# EAGLE design flexdrive_rev0 (EAGLE 6.5.0)
REV: 0; TITLE: FlexDrive

## Sheet 1 of 2
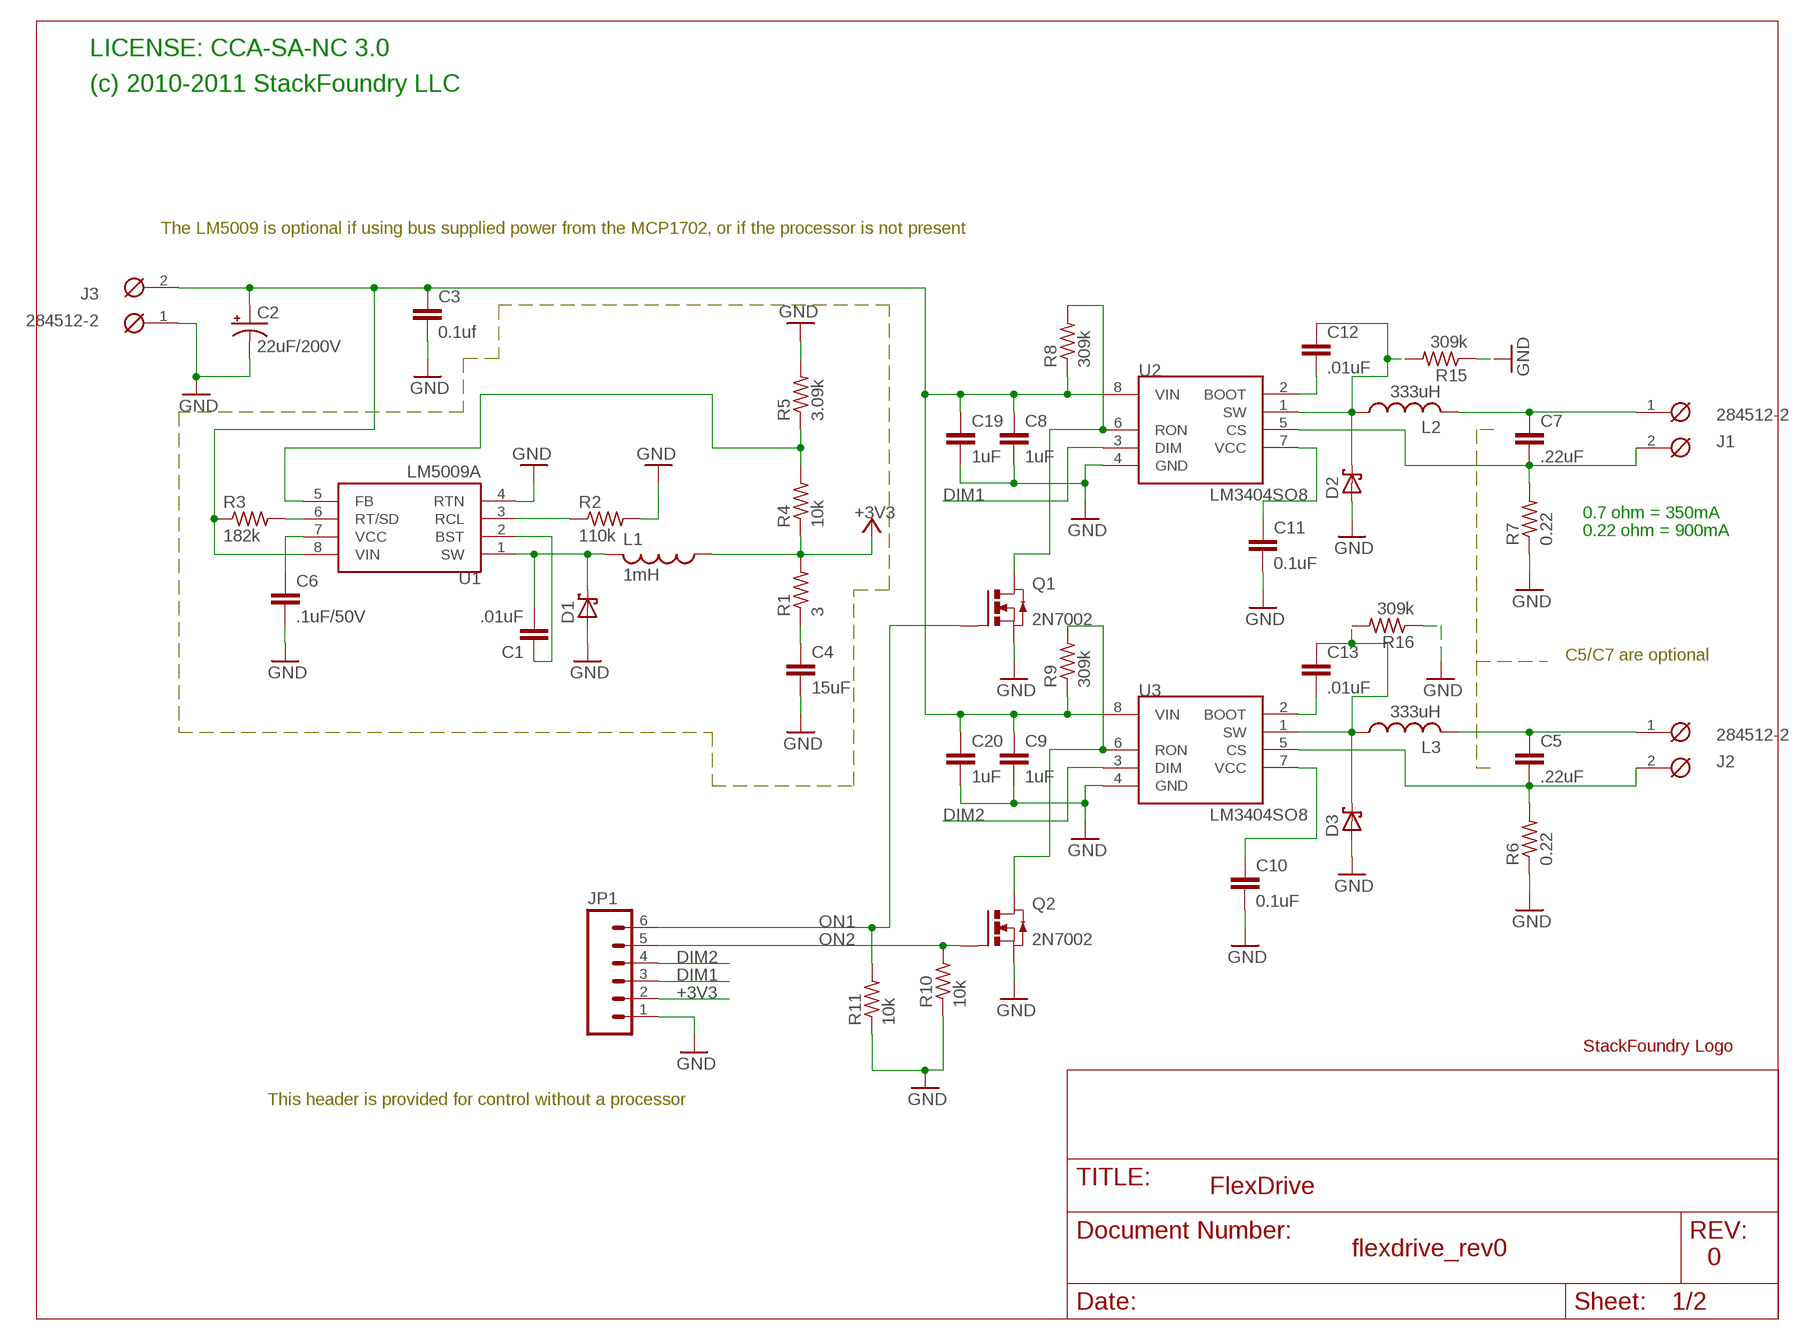
[diagram p0: schematic, sheet 1]

### Parts
C1  .01uF  C-EUC0603  [C0603]
C2  22uF/200V  CPOL-USE5-10.5  [E5-10,5]
C3  0.1uf  C-EUC0805  [C0805]
C4  15uF  C-EUTANTD_R  [CT7343]
C5  .22uF  C-EUC1206  [C1206]
C6  .1uF/50V  C-EUC1206  [C1206]
C7  .22uF  C-EUC1206  [C1206]
C8  1uF  C-EUC1206  [C1206]
C9  1uF  C-EUC1206  [C1206]
C10  0.1uF  C-EUC1206  [C1206]
C11  0.1uF  C-EUC1206  [C1206]
C12  .01uF  C-EUC1206  [C1206]
C13  .01uF  C-EUC1206  [C1206]
C19  1uF  C-EUC1206  [C1206]
C20  1uF  C-EUC1206  [C1206]
D1  SCHOTTKY-DIODESMA  [SMA]
D2  SCHOTTKY-DIODESMA  [SMA]
D3  SCHOTTKY-DIODESMA  [SMA]
J1  284512-2  [284512-2]
J2  284512-2  [284512-2]
J3  284512-2  [284512-2]
JP1  M06SIP  [1X06]
L1  1mH  L-USMSS1246  [MSS1246]
L2  333uH  L-USDO5040H  [DO5040H]
L3  333uH  L-USDO5040H  [DO5040H]
LOGO1  SFLOGO  [SFLOGO]
Q1  2N7002  [SOT23]
Q2  2N7002  [SOT23]
R1  3  R-US_R0603  [R0603]
R2  110k  R-US_R0603  [R0603]
R3  182k  R-US_R0603  [R0603]
R4  10k  R-US_R0603  [R0603]
R5  3.09k  R-US_R0603  [R0603]
R6  0.22  R-US_R1206  [R1206]
R7  0.22  R-US_R1206  [R1206]
R8  309k  R-US_R0805  [R0805]
R9  309k  R-US_R0805  [R0805]
R10  10k  R-US_R0603  [R0603]
R11  10k  R-US_R0603  [R0603]
R15  309k  R-US_R0805  [R0805]
R16  309k  R-US_R0805  [R0805]
U1  LM5009A  [MSOP-8]
U2  LM3404SO8  [SO08]
U3  LM3404SO8  [SO08]

### Nets
+3V3: JP1.2 L1.1 R1.2 R4.1 ; also sheet 2
DIM1: JP1.3 U2.3(DIM) ; also sheet 2
DIM2: JP1.4 U3.3(DIM) ; also sheet 2
GND: C2.- C3.2 C4.- C6.2 C8.2 C9.2 C10.2 C11.2 C19.2 C20.2 D1.A D2.A D3.A J3.1 JP1.1 Q1.2(S) Q2.2(S) R2.2 R5.2 R6.1 R7.1 R10.1 R11.1 R15.1 R16.1 U1.4(RTN) U2.4(GND) U3.4(GND) ; also sheet 2
N$1: C2.+ C3.1 C8.1 C9.1 C19.1 C20.1 J3.2 R3.1 R8.1 R9.1 U1.8(VIN) U2.8(VIN) U3.8(VIN)
N$2: C1.2 D1.C L1.2 U1.1(SW)
N$3: C1.1 U1.2(BST)
N$5: C4.+ R1.1
N$6: R2.1 U1.3(RCL)
N$7: R3.2 U1.6(RT/SD)
N$8: C6.1 U1.7(VCC)
N$9: R4.2 R5.1 U1.5(FB)
N$10: C12.1 D2.C L2.P$1 R15.2 U2.1(SW)
N$11: C13.1 D3.C L3.P$1 R16.2 U3.1(SW)
N$14: C7.1 J1.1 L2.P$2
N$15: C5.1 J2.1 L3.P$2
N$16: C7.2 J1.2 R7.2 U2.5(CS)
N$17: C10.1 U3.7(VCC)
N$18: C11.1 U2.7(VCC)
N$19: C13.2 U3.2(BOOT)
N$20: C12.2 U2.2(BOOT)
N$21: C5.2 J2.2 R6.2 U3.5(CS)
N$22: Q1.3(D) R8.2 U2.6(RON)
N$23: Q2.3(D) R9.2 U3.6(RON)
ON1: JP1.6 Q1.1(G) R11.2 ; also sheet 2
ON2: JP1.5 Q2.1(G) R10.2 ; also sheet 2

### Notes on the sheet
- LICENSE: CCA-SA-NC 3.0
- (c) 2010-2011 StackFoundry LLC
- The LM5009 is optional if using bus supplied power from the MCP1702, or if the processor is not present
- 0.7 ohm = 350mA
- 0.22 ohm = 900mA
- C5/C7 are optional
- This header is provided for control without a processor

## Sheet 2 of 2
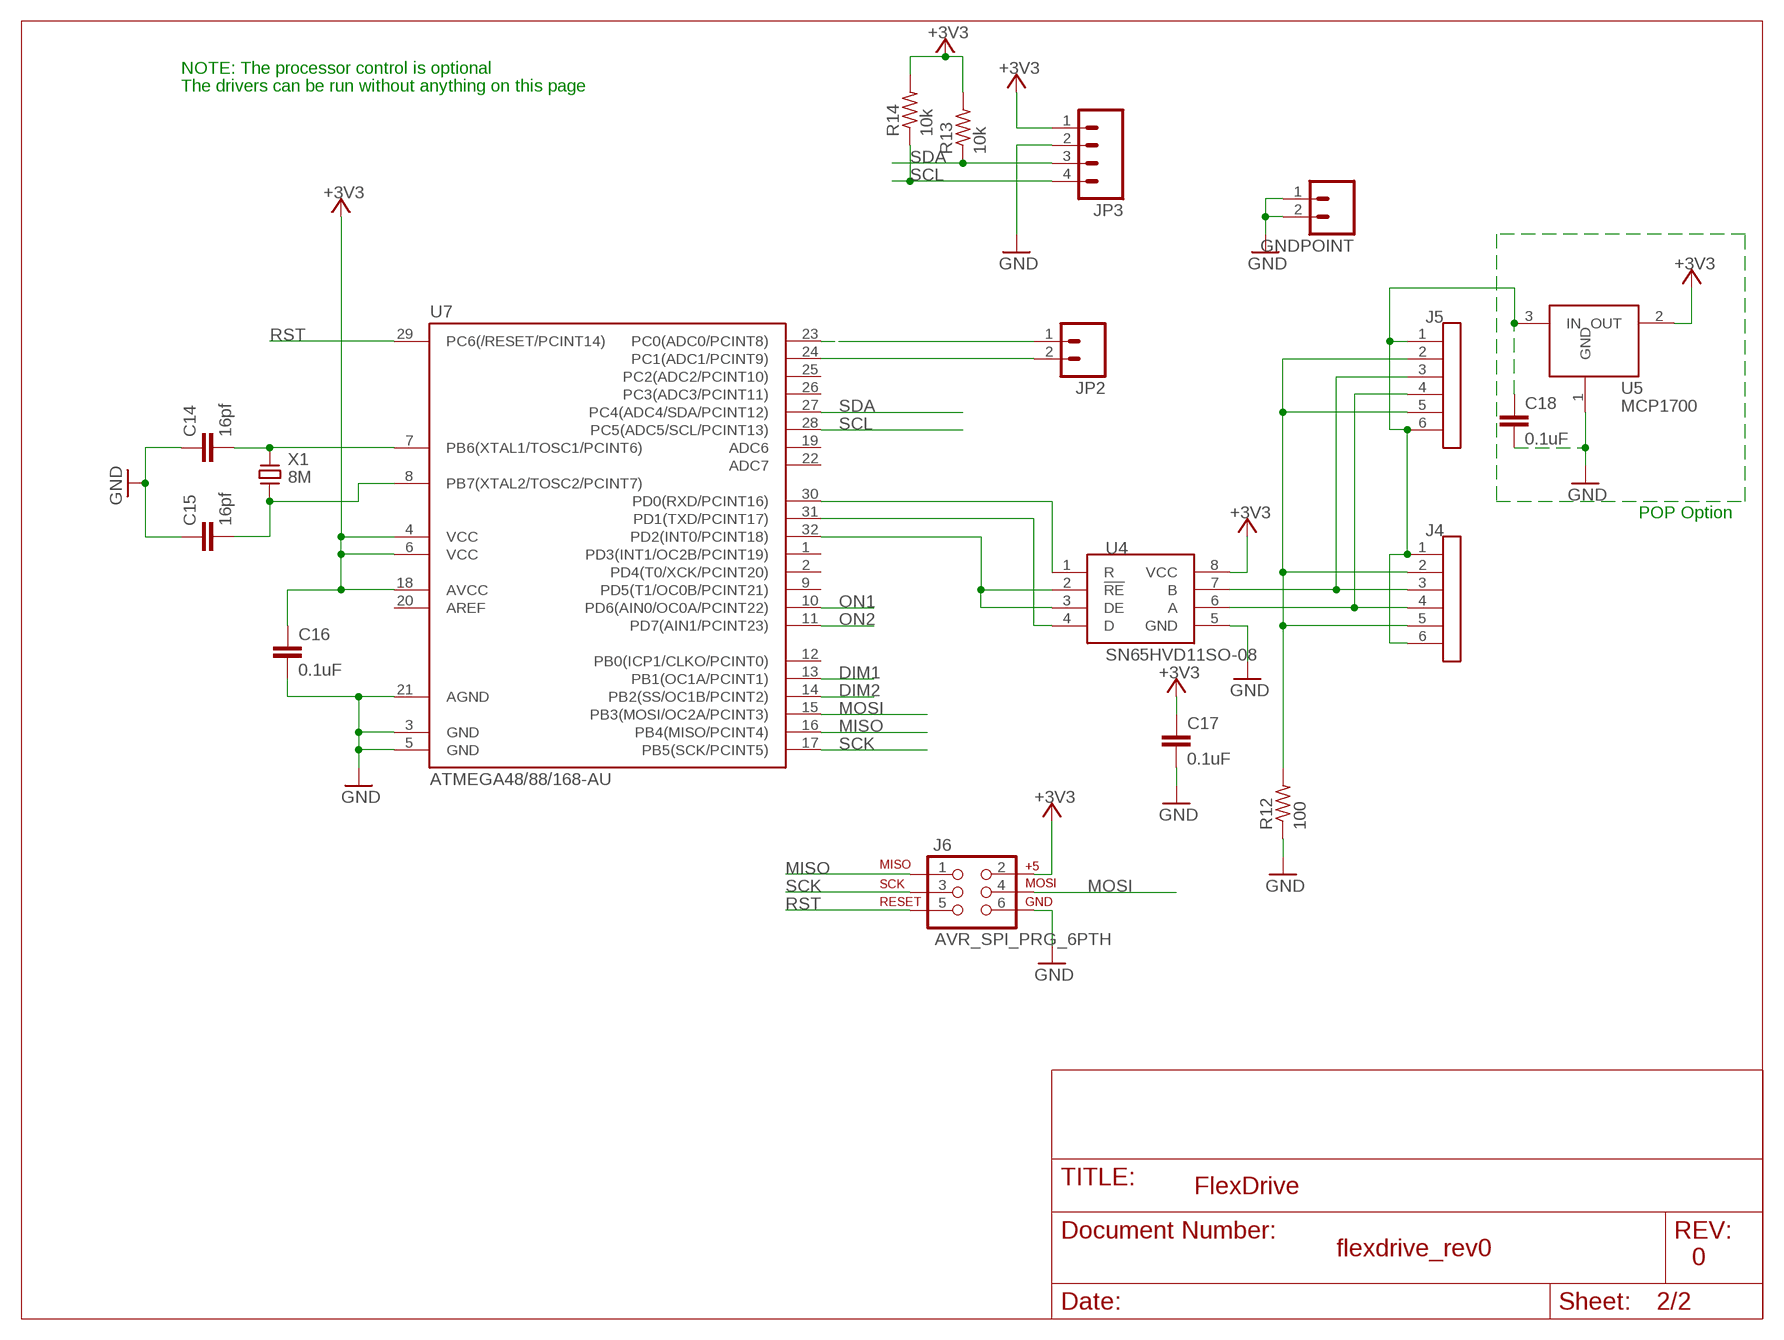
[diagram p1: schematic, sheet 2]

### Parts
C14  16pf  C-EUC0603  [C0603]
C15  16pf  C-EUC0603  [C0603]
C16  0.1uF  C-EUC0603  [C0603]
C17  0.1uF  C-EUC0603  [C0603]
C18  0.1uF  C-EUC0603  [C0603]
GNDPOINT  M02PTH  [1X02]
J4  RJ12  [A-2004-RJ12]
J5  RJ12  [A-2004-RJ12]
J6  AVR_SPI_PRG_6PTH  [2X3]
JP2  M02PTH  [1X02]
JP3  M04PTH  [1X04]
R12  100  R-US_R0603  [R0603]
R13  10k  R-US_R0603  [R0603]
R14  10k  R-US_R0603  [R0603]
U4  SN65HVD11SO-08  [SO-08]
U5  MCP1700  [SOT23]
U7  ATMEGA48/88/168-AU  [TQFP32-08]
X1  8M  HCM49_18.432M  [HCM49]

### Nets
+3V3: C16.1 C17.1 J6.2 JP3.1 R13.2 R14.2 U4.8(VCC) U5.2(OUT) U7.4(VCC) U7.6(VCC) U7.18(AVCC) ; also sheet 1
DIM1: U7.13(PB1(OC1A/PCINT1)) ; also sheet 1
DIM2: U7.14(PB2(SS/OC1B/PCINT2)) ; also sheet 1
GND: C14.1 C15.1 C16.2 C17.2 C18.2 GNDPOINT.1 GNDPOINT.2 J6.6 JP3.2 R12.1 U4.5(GND) U5.1(GND) U7.3(GND) U7.5(GND) U7.21(AGND) ; also sheet 1
MISO: J6.1 U7.16(PB4(MISO/PCINT4))
MOSI: J6.4 U7.15(PB3(MOSI/OC2A/PCINT3))
N$4: U4.2(!RE) U4.3(DE) U7.32(PD2(INT0/PCINT18))
N$12: C14.2 U7.7(PB6(XTAL1/TOSC1/PCINT6)) X1.P$1
N$13: C15.2 U7.8(PB7(XTAL2/TOSC2/PCINT7)) X1.P$2
N$24: U4.1(R) U7.30(PD0(RXD/PCINT16))
N$25: U4.4(D) U7.31(PD1(TXD/PCINT17))
N$26: J4.3 J5.3 U4.7(B)
N$27: J4.4 J5.4 U4.6(A)
N$28: J4.2 J4.5 J5.2 J5.5 R12.2
N$29: C18.1 J4.1 J4.6 J5.1 J5.6 U5.3(IN)
N$31: JP2.1 U7.23(PC0(ADC0/PCINT8))
N$32: JP2.2 U7.24(PC1(ADC1/PCINT9))
ON1: U7.10(PD6(AIN0/OC0A/PCINT22)) ; also sheet 1
ON2: U7.11(PD7(AIN1/PCINT23)) ; also sheet 1
RST: J6.5 U7.29(PC6(/RESET/PCINT14))
SCK: J6.3 U7.17(PB5(SCK/PCINT5))
SCL: JP3.4 R14.1 U7.28(PC5(ADC5/SCL/PCINT13))
SDA: JP3.3 R13.1 U7.27(PC4(ADC4/SDA/PCINT12))
Unconnected: U7.1(PD3(INT1/OC2B/PCINT19)) U7.2(PD4(T0/XCK/PCINT20)) U7.9(PD5(T1/OC0B/PCINT21)) U7.12(PB0(ICP1/CLKO/PCINT0)) U7.19(ADC6) U7.20(AREF) U7.22(ADC7) U7.25(PC2(ADC2/PCINT10)) U7.26(PC3(ADC3/PCINT11))

### Notes on the sheet
- NOTE: The processor control is optional
- The drivers can be run without anything on this page
- POP Option

## Library data of the parts
C1 C3-C20 = rcl:C-EU: CAPACITOR, European symbol
C2 = rcl:CPOL-US: POLARIZED CAPACITOR, American symbol
D1-D3 = diode:SCHOTTKY-DIODE: Schottky Diode
GNDPOINT JP2 = con-headers:M02
J1-J3 = con-tyco:284512-2: Terminal Block, Header Assembly, 90°, Closed Ends, 2 Pin, 3.5mm Pitch
J4 J5 = con-jack:RJ12
J6 = SparkFun:AVR_SPI_PRG_6: AVR ISP 6 Pin This is the reduced ISP connector for AVR programming. Common on Arduino. This footprint will take up less PCB space and can be used with a 10-pin to 6-pin adapter such as SKU: BOB-08508
JP1 = con-headers:M06
JP3 = con-headers:M04
L1-L3 = rcl:L-US: INDUCTOR, American symbol
LOGO1 = logos:SFLOGO
Q1 Q2 = onsemi:2N7002: Small Signal MOSFET, N-Channel, SOT-23
R1-R16 = rcl:R-US_: RESISTOR, American symbol
U1 = national-semiconductor:LM5009A: 100V, 150mA Constant On-Time Buck Switching Regulator
U2 U3 = national-semiconductor:LM3404
U4 = texas:SN65HVD11: 3.3V RS-485 Transceiver, Half-Duplex
U5 = microchip:MCP1700
U7 = atmel:ATMEGA48/88/168
X1 = xtal:HCM49_18.432M: 18.432 MHz SMD Crystal

## Board
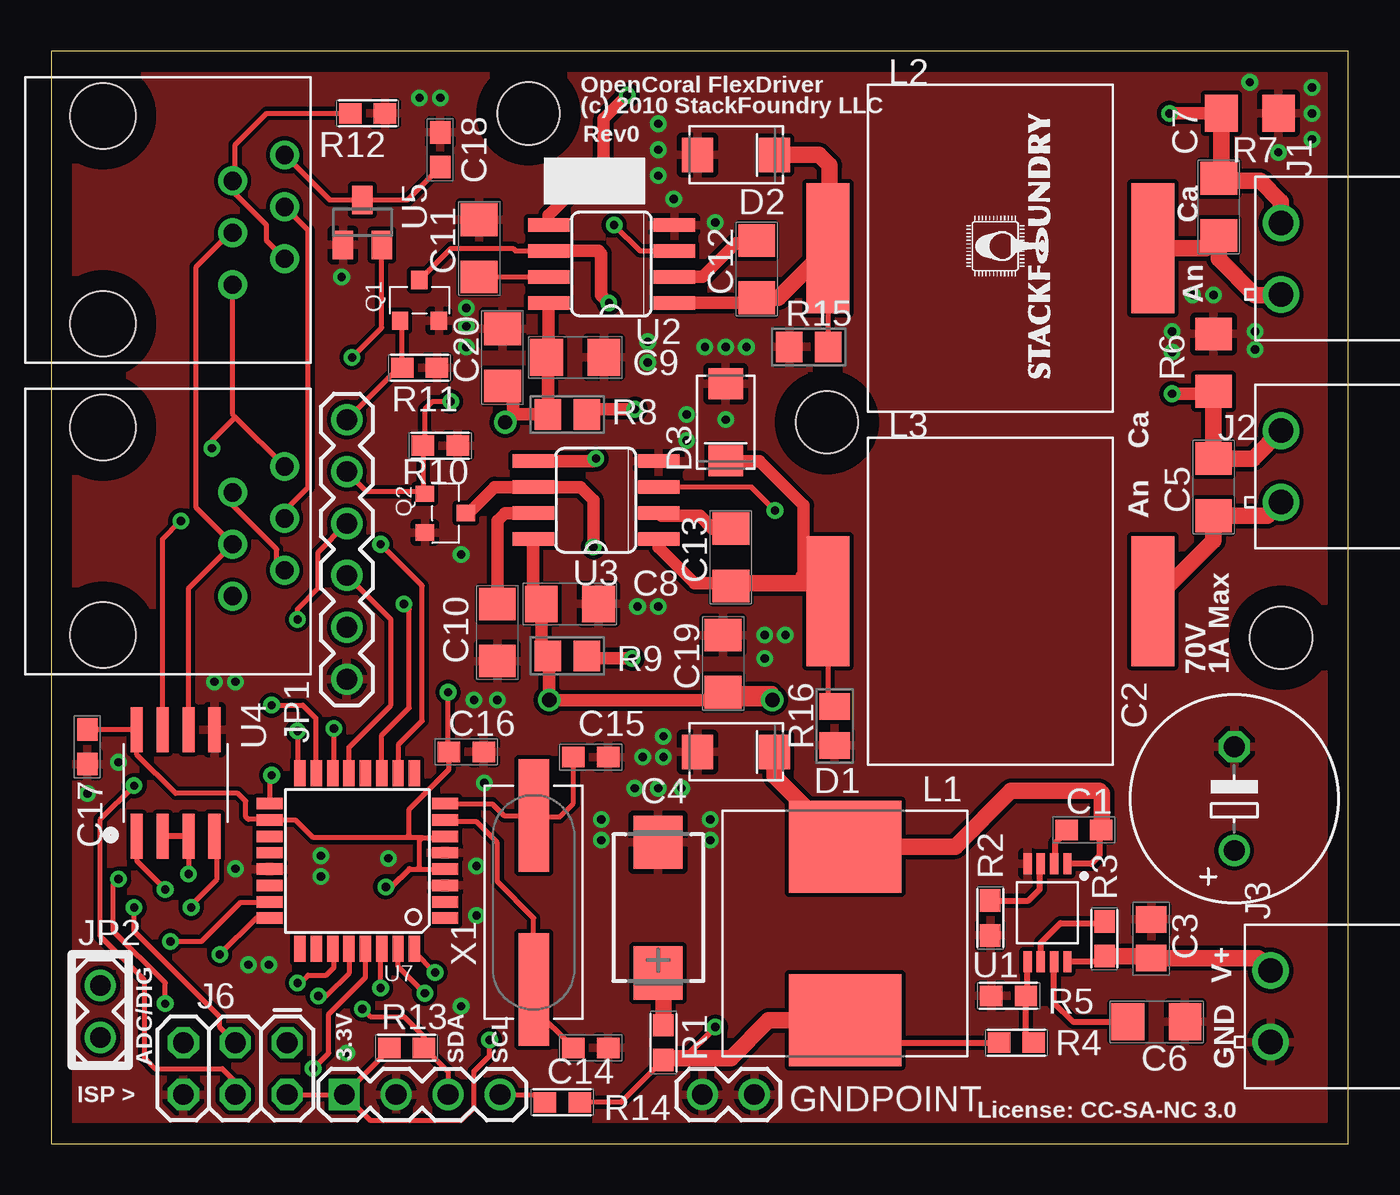
[diagram p2: board, top side]
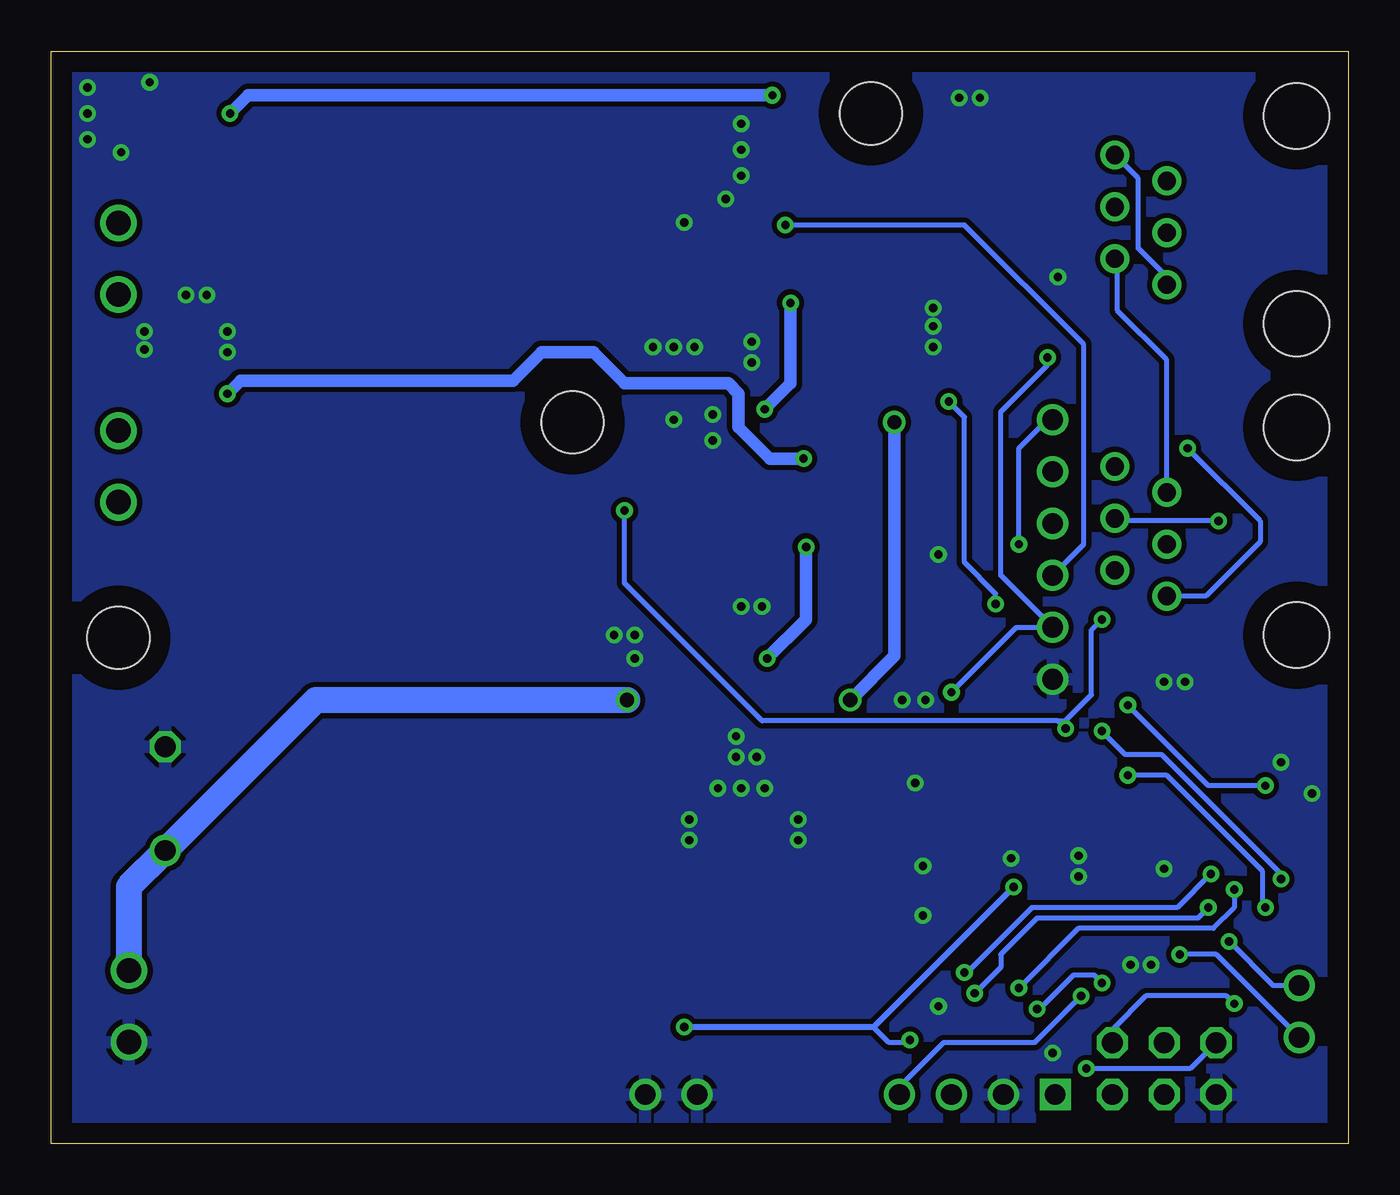
[diagram p3: board, bottom side, seen from below]

Size 63.5 x 53.47 mm. Coordinates in mm from the lower left corner, seen from the top.
Outline: 0,0 63.5,0 63.5,53.47 0,53.47 0,0
Copper layers (1*16): Top 0.035mm / dielectric 1.5mm / Bottom 0.035mm
Design rules "default *": minimum track width 8mil, minimum drill 16mil, track to track 8mil, track to pad 8mil, pad to pad 8mil, via to via 8mil, smd to smd 8mil, copper to edge 40mil, drill to drill 8mil, minimum pad ring 10mil, minimum via ring 8mil, stop-mask expansion 4mil, vias tented up to drill 16mil, thermal gap 10mil
Holes 3.05 mm at 60.2,24.77 23.37,50.42 37.97,35.31
tKeepout: area 39.9,18.5 to 51.9,51.4

### Footprints (pad centres in the part's own frame; a part is rotated, then mirrored left to right if it is on the bottom)
C0603 = smd 1.1 x 1: 1 -0.85,0; 2 0.85,0
E5-10,5 = drill 1.016: + -2.54,0 | drill 1.016 octagon: - 2.54,0
C0805 = smd 1.3 x 1.5: 1 -0.95,0; 2 0.95,0
CT7343 = smd 2.6 x 2.4: + 3.2,0; - -3.2,0
C1206 = smd 1.6 x 1.8: 1 -1.4,0; 2 1.4,0
SMA = smd 1.524 x 1.676: A 1.88,0; C -1.88,0
1X02 = drill 1.016: 1 0,0; 2 2.54,0
284512-2 = drill 1.2: 1 -1.75,0; 2 1.75,0
A-2004-RJ12 = drill 0.9: 1 -5.08,0; 2 -3.81,-2.54; 3 -2.54,0; 4 -1.27,-2.54; 5 0,0; 6 1.27,-2.54 | hole 3.2: -6.99,-8.89; 3.18,-8.89
2X3 = drill 1.016 octagon: 1 0,0; 2 0,2.54; 3 2.54,0; 4 2.54,2.54; 5 5.08,0; 6 5.08,2.54
1X06 = drill 1.016: 1 0,0; 2 2.54,0; 3 5.08,0; 4 7.62,0; 5 10.16,0; 6 12.7,0
1X04 = drill 1.016 square: 1 0,0 | drill 1.016: 2 2.54,0; 3 5.08,0; 4 7.62,0
MSS1246 = smd 4.5 x 5.5: 1 -4.25,0; 2 4.25,0
DO5040H = smd 2.1 x 6.35: P$1 -7.95,0; P$2 7.95,0
SOT23 = smd 0.8 x 0.9: 1 -0.95,-1; 2 0.95,-1; 3 0,1
R0603 = smd 1.1 x 1: 1 -0.85,0; 2 0.85,0
R1206 = smd 1.6 x 1.8: 1 -1.4,0; 2 1.4,0
R0805 = smd 1.3 x 1.5: 1 -0.95,0; 2 0.95,0
MSOP-8 = smd 0.41 x 1.02: 1 -0.975,-2.4; 2 -0.325,-2.4; 3 0.325,-2.4; 4 0.975,-2.4; 5 0.975,2.4; 6 0.325,2.4; 7 -0.325,2.4; 8 -0.975,2.4
SO08 = smd 0.66 x 2.032: 1 -1.905,-3.073; 2 -0.635,-3.073; 3 0.635,-3.073; 4 1.905,-3.073; 5 1.905,3.073; 6 0.635,3.073; 7 -0.635,3.073; 8 -1.905,3.073
SO-08 = smd 0.6 x 2.2: 1 -1.905,-2.6; 2 -0.635,-2.6; 3 0.635,-2.6; 4 1.905,-2.6; 5 1.905,2.6; 6 0.635,2.6; 7 -0.635,2.6; 8 -1.905,2.6
SOT23' = smd 1 x 1.4: 1 -0.95,-1.1; 2 0.95,-1.1; 3 0,1.1
TQFP32-08 = smd 1.27 x 0.559: 1 -4.293,2.8; 2 -4.293,2; 3 -4.293,1.2; 4 -4.293,0.4; 5 -4.293,-0.4; 6 -4.293,-1.2; 7 -4.293,-2; 8 -4.293,-2.8; 17 4.293,-2.8; 18 4.293,-2; 19 4.293,-1.2; 20 4.293,-0.4; 21 4.293,0.4; 22 4.293,1.2; 23 4.293,2; 24 4.293,2.8 | smd 0.559 x 1.27: 9 -2.8,-4.293; 10 -2,-4.293; 11 -1.2,-4.293; 12 -0.4,-4.293; 13 0.4,-4.293; 14 1.2,-4.293; 15 2,-4.293; 16 2.8,-4.293; 25 2.8,4.293; 26 2,4.293; 27 1.2,4.293; 28 0.4,4.293; 29 -0.4,4.293; 30 -1.2,4.293; 31 -2,4.293; 32 -2.8,4.293
HCM49 = smd 5.5 x 1.5: P$1 -4.25,0; P$2 4.25,0

### Placement (x,y rotation side)
C1  50.55,15.37 0 top
C2  57.91,16.89 90 top
C3  53.85,10.03 90 top
C4  29.72,11.56 270 top
C5  56.9,32.13 90 top
C6  54.1,5.97 0 top
C7  57.15,45.85 90 top
C8  25.4,26.42 0 top
C9  25.65,38.48 0 top
C10  21.84,25.02 270 top
C11  20.95,43.82 90 top
C12  34.54,42.8 90 top
C13  33.27,28.7 90 top
C14  26.42,4.7 180 top
C15  26.42,18.92 180 top
C16  20.32,19.18 0 top
C17  1.78,19.43 270 top
C18  19.05,48.64 90 top
C19  32.89,23.49 90 top
C20  22.1,38.48 90 top
D1  33.53,19.18 180 top
D2  33.53,48.39 180 top
D3  33.02,35.31 90 top
GNDPOINT  31.88,2.41 0 top
J1  60.2,43.31 90 top
J2  60.2,33.15 90 top
J3  59.69,6.73 90 top
J4  11.43,43.31 270 top
J5  11.43,28.07 270 top
J6  11.56,4.95 180 top
JP1  14.48,22.73 90 top
JP2  2.41,7.75 270 top
JP3  14.35,2.41 0 top
L1  38.86,10.29 90 top
L2  45.97,43.82 0 top
L3  45.97,26.54 0 top
LOGO1  48.9,37.47 90 top
Q1  18.03,41.27 0 top
Q2  19.3,30.86 270 top
R1  29.97,4.95 270 top
R2  45.97,11.05 270 top
R3  51.56,10.03 90 top
R4  47.24,4.95 0 top
R5  46.86,7.24 180 top
R6  56.9,38.23 270 top
R7  58.67,50.42 180 top
R8  25.27,35.69 0 top
R9  25.27,23.88 0 top
R10  19.05,34.16 180 top
R11  18.03,37.97 180 top
R12  15.49,50.42 180 top
R13  17.4,4.7 180 top
R14  25.02,2.03 0 top
R15  37.08,38.99 0 top
R16  38.35,20.45 90 top
U1  48.77,11.3 180 top
U2  27.43,43.05 90 top
U3  26.67,31.5 90 top
U4  6.1,17.65 0 top
U5  MCP1700  [SOT23']  15.24,45.09 0 top
U7  14.99,13.84 180 top
X1  23.62,11.81 90 top

### Tracks (layer width: path | path; a pad name or v marks a point on that pad's centre or on a via)
+3V3  (via drill 0.41)
  Top 0.254: C17.1 1.81,20.25 U4.8 4.19,19.05 6.1,17.14 9.14,17.14 9.53,16.76 9.53,16 9.65,15.88 10.66,15.88 U7.18 11.97,15.84 12.83,14.99 17.4,14.99 | U5.2 16.19,39.94 v14.73,38.48 | v19.43,22.1 19.43,19.22 C16.1 19.47,18.33 17.53,16.38 17.53,15.11 17.4,14.99 | 17.55,13.44 17.91,13.44 | 17.91,13.44 U7.4 | 18.16,14.99 17.4,14.99 | U7.6 19.22,14.99 18.16,14.99 | 18.16,14.99 18.03,14.86 18.03,13.57 17.91,13.44 | R13.2 16.55,4.61 JP3.1 | R14.2 27.9,2.03 R1.2 | v21.46,5.08 21.46,4.32 20.7,3.56 20.7,1.78 20.07,1.14 15.62,1.14 JP3.1 | J6.2 JP3.1
  Top 0.305: R4.1 39.95,4.95 L1.1 | 30.06,4.19 30.99,4.19 v32.51,5.71 | v16.38,12.57 16.68,12.57 17.55,13.44
  Top 0.813: L1.1 35.12,6.04 33.27,4.19 30.06,4.19 R1.2
  Bottom 0.254: v14.73,38.48 14.73,38.1 17.02,35.81 17.02,27.81 JP1.2 16.26,25.27 v19.43,22.1 | 23.24,5.71 22.48,4.95 21.59,4.95 v21.46,5.08
  Bottom 0.305: v32.51,5.71 23.24,5.71 v16.38,12.57
DIM1  (via drill 0.41)
  Top 0.254: U2.3 28.83,43.69 v27.56,44.96 | U7.13 14.59,19.41 16.64,21.46 16.64,25.65 JP1.3
  Bottom 0.254: v27.56,44.96 18.8,44.96 12.95,39.12 12.95,29.34 JP1.3
DIM2  (via drill 0.41)
  Top 0.254: U3.3 34.29,32.13 v35.43,30.99 | v13.84,20.32 13.84,18.19 U7.14 | v12.06,25.65 12.06,26.16 13.08,27.18 13.08,28.96 JP1.4
  Bottom 0.254: v35.43,30.99 35.43,27.43 28.7,20.7 14.22,20.7 | v13.84,20.32 14.22,20.7 | 14.22,20.7 13.84,20.7 12.57,21.97 12.57,25.15 v12.06,25.65
GND  (via drill 0.41)
  other vias: 28.96,18.92 20.83,13.59 20.07,6.73 29.72,17.4 32.26,14.86 26.92,14.86 29.97,19.94 33.02,38.99 34.04,38.99 32,38.99 28.7,26.29 29.72,26.29 29.72,49.91 29.72,48.64 29.72,47.37 61.72,50.42 61.72,51.69 61.72,49.15 54.86,39.75 56.9,41.53 58.93,39.75 18.03,51.18 19.05,51.18 20.32,40.01 20.32,38.99 29.21,38.23 20.7,21.72 21.84,21.72 3.3,18.67 1.78,17.14 8,22.61 21.21,17.65 9.02,13.46 13.21,13.08 16.51,13.97 13.21,14.1 31.11,35.69 33.02,35.43 34.92,24.89 34.92,23.75 35.94,24.89 29.21,39.24 20.32,40.89 29.97,18.92 28.57,17.4 30.86,17.4 26.92,15.88 32.26,15.88 55.88,41.53 58.93,38.86 54.86,38.73 14.22,42.42 20.07,28.83 9.02,22.61 20.83,11.18 58.67,51.94 60.07,48.51 30.48,46.23 32.51,45.09 31.11,34.42 14.48,4.45 10.67,8.76 9.65,8.76
  pour Top: 0,53.47 0.13,-0.51 63.37,-0.51 63.25,53.47
  pour Bottom (isolate 0.254): 0,53.09 63.37,53.09 63.5,-0.51 0.13,-0.51
MISO  (via drill 0.41)
  Top 0.254: v5.59,6.86 5.59,7.87 3.05,10.41 3.05,12.7 v3.3,12.95 | v12.06,20.19 12.06,18.26 U7.16
  Bottom 0.254: J6.1 11.56,5.59 9.91,7.24 5.97,7.24 v5.59,6.86 | v3.3,12.95 3.3,13.21 9.14,19.05 10.92,19.05 v12.06,20.19
MOSI  (via drill 0.41)
  Top 0.254: J6.4 9.02,3.05 8.38,3.68 5.08,3.68 4.57,4.19 4.57,8 2.41,10.16 2.41,15.88 v4.06,17.53 | v10.79,21.46 12.32,21.46 12.95,20.83 12.95,18.17 U7.15
  Bottom 0.254: v4.06,17.53 6.86,17.53 v10.79,21.46
N$1  (via drill 0.7)
  Top 0.305: U1.8 51.28,8.9 R3.1
  Top 0.61: U2.8 24.36,38.59 C9.1 24.32,38.41 R8.1 22.61,35.69 | U3.8 23.6,26.82 C8.1 24,24.2 R9.1 24.38,23.81 v24.38,21.72 v35.31,21.72 35.31,22.09 C19.1 | v22.23,35.31 22.61,35.69 | 22.61,35.69 22.61,36.57 C20.1
  Top 0.813: R3.1 53.75,9.18 C3.1 59.09,9.08 J3.2
  Bottom 0.61: v22.23,35.31 22.23,23.88 v24.38,21.72
  Bottom 1.27: J3.2 59.69,12.57 C2.+ 50.55,21.72 v35.31,21.72
N$2
  Top 0.305: U1.1 50.91,13.7 51.31,14.1 51.31,15.28 C1.2
  Top 0.813: D1.C 35.41,17.99 L1.2 44.26,14.54 46.99,17.27 51.31,17.27 51.44,17.14 51.44,15.41 C1.2
N$3
  Top 0.305: C1.1 49.7,15.28 49.15,14.73 49.15,13.76 U1.2
N$4  (via drill 0.41)
  Top 0.254: U7.32 17.79,9.39 v18.8,8.38 | U4.3 v6.73,13.21
  Top 0.305: U4.3 U4.2
  Bottom 0.254: v18.8,8.38 18.67,8.38 15.49,11.56 8.38,11.56 v6.73,13.21
N$5
  Top 0.254: 29.97,8.1 C4.+
  Top 0.813: R1.1 29.97,8.1
N$6
  Top 0.305: R2.1 47.84,11.9 48.39,12.45 48.39,13.65 U1.3
N$7
  Top 0.305: U1.6 48.44,9.84 49.4,10.79 51.47,10.79 R3.2
N$8
  Top 0.305: U1.7 49.09,6.91 50.04,5.97 C6.1
N$9
  Top 0.305: 47.92,5.13 R4.2 47.71,5.33 R5.1 47.79,7.32 U1.5
N$10
  Top 0.254: R15.2 38.03,42.36 37.3,43.09
  Top 0.61: U2.1 34.29,41.15 C12.1
  Top 0.813: D2.C 37.59,48.39 38.1,47.88 38.1,43.89 L2.P$1 37.3,43.09 35.61,41.4 C12.1
N$11
  Top 0.254: L3.P$1 38.02,21.73 R16.2
  Top 0.61: U3.1 29.74,29.19 31.5,27.43 33.14,27.43 C13.1 | D3.C 33.05,33.4 34.67,33.4 36.83,31.24 36.83,27.74
  Top 0.813: C13.1 33.4,27.43 37.13,27.43 | 37.13,27.43 L3.P$1 | 37.13,27.43 36.83,27.74
N$12
  Top 0.254: U7.7 19.37,15.75 20.83,15.75 21.84,14.73 21.84,12.83 23.62,11.05 X1.P$1 23.62,6.64 C14.2
N$13
  Top 0.254: U7.8 21.59,16.64 22.17,16.06 X1.P$2 23.68,16 24.89,16 25.57,16.68 C15.2
N$14
  Top 0.813: L2.P$2 56.52,43.82 C7.1 57.15,43.31 58.93,41.53 60.17,41.53 J1.1
N$15
  Top 0.813: J2.1 59.53,30.73 C5.1 56.9,29.52 L3.P$2
N$16  (via drill 0.41)
  Top 0.61: v54.74,50.42 R7.2 | v28.19,51.31 27.05,50.16 27.05,48.13 24.36,45.44 U2.5
  Top 0.813: J1.2 60.2,46.1 59.18,47.12 57.28,47.12 C7.2 57.27,47.37 R7.2
  Bottom 0.61: v28.19,51.31 53.85,51.31 v54.74,50.42
N$17
  Top 0.61: C10.1 21.84,30.48 22.23,30.86 U3.7
N$18
  Top 0.254: C11.1 U2.7
  Top 0.61: U2.7
N$19
  Top 0.61: C13.2 32.38,30.1 31.75,30.73 29.87,30.73 U3.2
N$20
  Top 0.61: U2.2 31.88,42.42 33.53,44.07 34.41,44.07 C12.2
N$21  (via drill 0.41)
  Top 0.61: U3.5 26.54,33.4 v26.67,33.53 | v54.86,36.7 56.77,36.7 R6.2
  Top 0.813: R6.2 C5.2 58.83,33.53 J2.2
  Bottom 0.61: v54.86,36.7 54.23,37.34 40.89,37.34 39.5,38.73 36.96,38.73 35.43,37.21 30.35,37.21 29.84,36.7 29.84,35.05 28.32,33.53 v26.67,33.53
N$22  (via drill 0.41)
  Top 0.254: U2.6 22.73,43.69 22.61,43.82 19.57,43.82 Q1.3
  Top 0.61: U2.6 26.8,43.69 26.92,43.56 26.92,41.53 v27.3,41.15 | v28.57,35.94 26.48,35.94 R8.2
  Bottom 0.61: v27.3,41.15 27.3,37.21 v28.57,35.94
N$23  (via drill 0.41)
  Top 0.61: Q2.3 20.45,30.86 21.72,32.13 U3.6 25.91,32.13 26.54,31.5 v26.54,29.21 | v28.45,23.75 26.35,23.75 R9.2
  Bottom 0.61: v26.54,29.21 26.54,25.65 v28.45,23.75
N$24  (via drill 0.41)
  Top 0.254: U4.1 4.19,13.84 v5.59,12.45 | v16.13,7.62 16.13,9.49 U7.30
  Bottom 0.254: v5.59,12.45 5.59,11.56 6.6,10.54 13.21,10.54 v16.13,7.62
N$25  (via drill 0.41)
  Top 0.254: U7.31 16.99,8.67 v18.29,7.37 | v6.86,11.56 6.86,11.68 8.13,12.95 8.13,14.93 U4.4
  Bottom 0.254: v18.29,7.37 17.02,8.64 17.02,9.27 15.24,11.05 7.37,11.05 v6.86,11.56
N$26  (via drill 0.41)
  Top 0.254: U4.7 5.46,29.59 v6.35,30.48 | J5.3 11.43,30.99 12.57,32.13 12.57,44.7 J4.3
  Bottom 0.254: v6.35,30.48 11.3,30.48 J5.3
N$27
  Top 0.254: U4.6 6.73,27.18 J5.4 7.11,31.12 7.11,42.93 8.76,44.58 J4.4
N$28
  Top 0.254: R12.2 10.54,50.42 9.02,48.9 9.02,47.24 J4.2 8.89,46.61 10.54,44.96 10.54,44.2 J4.5 | J5.2 8.89,31.24 11.05,29.08 11.05,28.45 J5.5
  Bottom 0.254: J5.2 8.89,38.35 11.3,40.77 11.3,43.18 J4.5
N$29  (via drill 0.41)
  Top 0.254: C18.1 17.44,46.19 U5.3 13.63,46.19 J4.1 | J4.6 8.89,35.69 9.02,35.56 | 9.02,35.56 J5.1 | v7.87,34.04 7.87,34.42 9.02,35.56
  Bottom 0.254: J5.6 6.99,26.8 4.32,29.46 4.32,30.48 v7.87,34.04 | J4.6 8.89,42.42 10.29,43.82 10.29,47.24 J4.1
N$31  (via drill 0.41)
  Top 0.254: v5.84,9.91 7.37,9.91 9.27,11.81 10.66,11.81 U7.23
  Bottom 0.254: JP2.1 3.68,7.75 v5.84,9.91
N$32  (via drill 0.41)
  Top 0.254: 10.92,11.05 U7.24 10.03,11.04 v8.26,9.27
  Bottom 0.254: v8.26,9.27 6.48,9.27 JP2.2
ON1  (via drill 0.41)
  Top 0.254: Q1.1 17.18,40.18 R11.2 17.02,37.97 JP1.6 | v16.13,29.34 18.16,27.3 18.16,20.7 17.02,19.56 17.02,18.17 U7.10
  Bottom 0.254: v16.13,29.34 16.13,34.04 14.73,35.43 JP1.6
ON2  (via drill 0.41)
  Top 0.254: 18.2,31.91 R10.2 18.29,34.25 18.29,35.94 18.67,36.32 v19.56,36.32 | 18.2,31.91 Q2.1 | 18.2,31.91 15.46,31.91 JP1.5 | U7.11 16.19,20 17.53,21.34 17.53,26.16 v17.27,26.42
  Bottom 0.254: v17.27,26.42 17.27,26.92 18.8,28.45 18.8,35.56 v19.56,36.32
RST  (via drill 0.41)
  Top 0.254: U7.29 15.39,8.15 13.59,6.35 13.59,4.45 v12.83,3.68
  Bottom 0.254: v12.83,3.68 7.75,3.68 J6.5
SCK  (via drill 0.41)
  Top 0.254: U7.17 10.69,17.93 v10.79,18.03 | v4.06,11.56 4.06,10.41 8.26,6.22 8.26,5.71 J6.3
  Bottom 0.254: v10.79,18.03 8.89,18.03 4.19,13.33 4.19,11.68 v4.06,11.56
SCL  (via drill 0.41)
  Top 0.254: JP3.4 23.79,2.41 R14.1 | v13.08,7.24 13.46,7.24 14.61,8.38 14.61,9.53 U7.28
  Bottom 0.254: JP3.4 21.97,2.79 19.81,4.95 15.37,4.95 v13.08,7.24
SDA  (via drill 0.41)
  Top 0.254: JP3.3 19.43,3.52 R13.1 18.25,5.25 17.27,6.22 15.62,6.22 v15.24,6.6 | v12.06,7.87 12.19,7.87 12.57,8.25 13.46,8.25 13.84,8.64 13.84,9.49 U7.27
  Bottom 0.254: v15.24,6.6 15.11,6.6 13.46,8.25 12.45,8.25 v12.06,7.87

### Text on the board
tPlace: OpenCoral FlexDriver | (c) 2010 StackFoundry LLC | Rev0 | Ca | An | Ca | An | 70V | 1A Max | V+ | ADC/DIG | 3.3V | SDA | SCL | GND | ISP > | License: CC-SA-NC 3.0